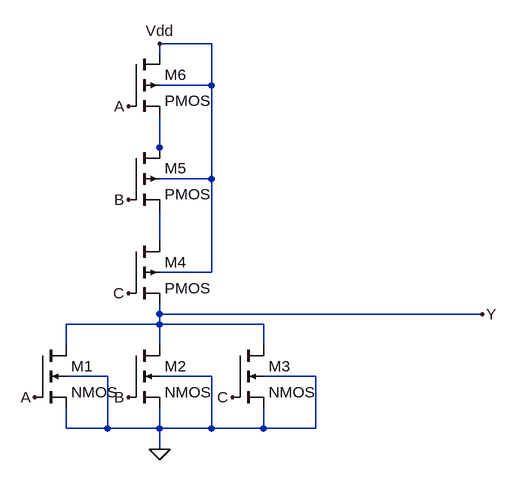
[diagram p0: schematic Draft5.asc]
Draft5.asc, the LTspice schematic file:
Version 4
SHEET 1 880 680
WIRE 320 -304 240 -304
WIRE 240 -288 240 -304
WIRE 320 -240 320 -304
WIRE 320 -240 240 -240
WIRE 240 -144 240 -192
WIRE 240 -128 240 -144
WIRE 320 -96 320 -240
WIRE 320 -96 240 -96
WIRE 240 0 240 -48
WIRE 320 48 320 -96
WIRE 320 48 240 48
WIRE 240 112 240 96
WIRE 736 112 240 112
WIRE 240 128 240 112
WIRE 240 128 96 128
WIRE 400 128 240 128
WIRE 96 160 96 128
WIRE 240 160 240 128
WIRE 400 160 400 128
WIRE 160 208 96 208
WIRE 320 208 240 208
WIRE 480 208 400 208
WIRE 96 288 96 256
WIRE 160 288 160 208
WIRE 160 288 96 288
WIRE 240 288 240 256
WIRE 240 288 160 288
WIRE 320 288 320 208
WIRE 320 288 240 288
WIRE 400 288 400 256
WIRE 400 288 320 288
WIRE 480 288 480 208
WIRE 480 288 400 288
WIRE 240 320 240 288
FLAG 240 320 0
FLAG 192 -208 A
FLAG 192 -64 B
FLAG 192 80 C
FLAG 48 240 A
FLAG 192 240 B
FLAG 352 240 C
FLAG 240 -304 Vdd
FLAG 736 112 Y
SYMBOL nmos4 48 160 R0
SYMATTR InstName M1
SYMBOL nmos4 192 160 R0
SYMATTR InstName M2
SYMBOL nmos4 352 160 R0
SYMATTR InstName M3
SYMBOL pmos4 192 0 R0
SYMATTR InstName M4
SYMBOL pmos4 192 -144 R0
SYMATTR InstName M5
SYMBOL pmos4 192 -288 R0
SYMATTR InstName M6

The netlist it stands for:
* Draft5.asc
M1 Y A 0 0 NMOS
M2 Y B 0 0 NMOS
M3 Y C 0 0 NMOS
M4 N002 C Y Vdd PMOS
M5 N001 B N002 Vdd PMOS
M6 Vdd A N001 Vdd PMOS
.model NMOS NMOS
.model PMOS PMOS
.lib standard.mos
.backanno
.end